# EAGLE schematic Connections (EAGLE 8.3.2)
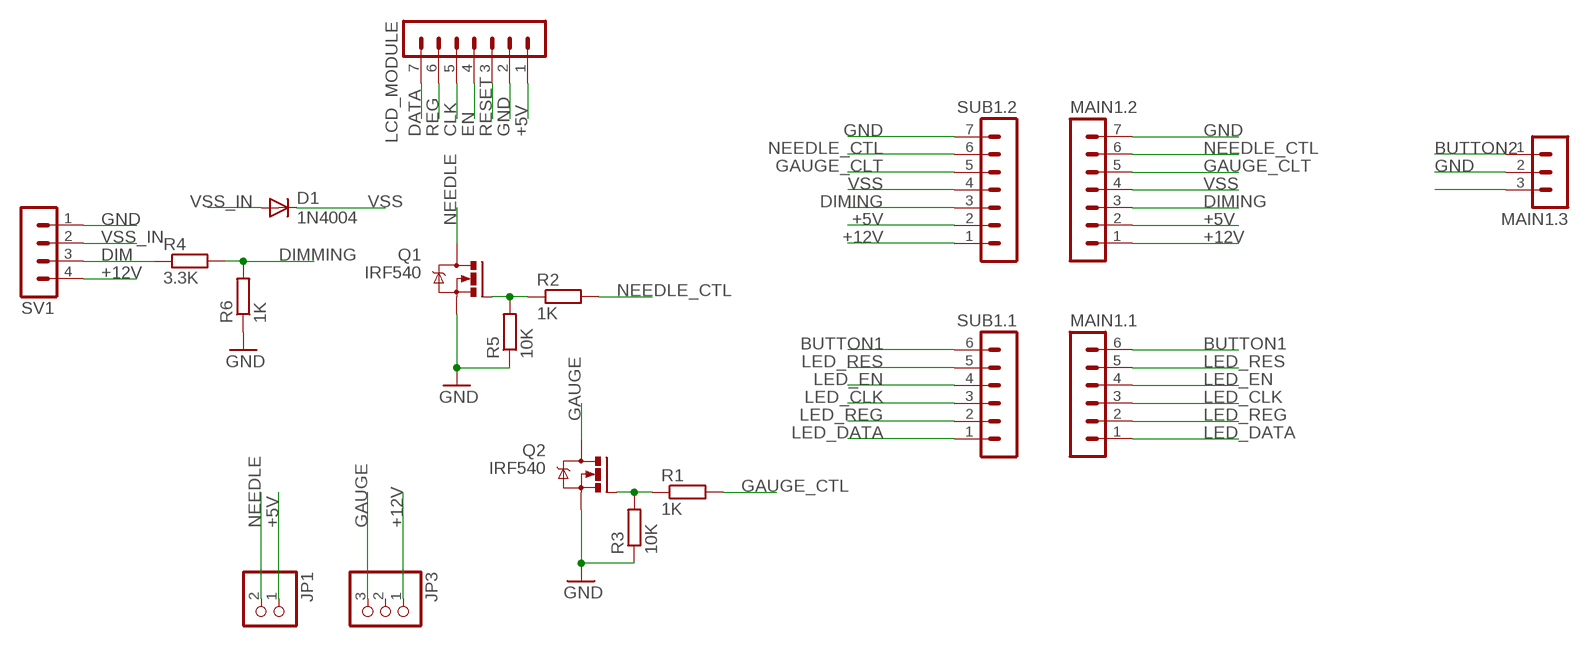
[diagram p0: schematic, sheet 1]

## Parts
D1  1N4004  [DO41-10]
JP1  PINHD-1X2  [1X02]
JP3  PINHD-1X3  [1X03]
LCD_MODULE  MA07-1  [MA07-1]
MAIN1.1  MA06-1  [MA06-1]
MAIN1.2  MA07-1  [MA07-1]
MAIN1.3  MA03-1  [MA03-1]
Q1  IRF540  [TO220BV]
Q2  IRF540  [TO220BV]
R1  1K  R-EU_0207/10  [0207/10]
R2  1K  R-EU_0207/10  [0207/10]
R3  10K  R-EU_0207/10  [0207/10]
R4  3.3K  R-EU_0207/10  [0207/10]
R5  10K  R-EU_0207/10  [0207/10]
R6  1K  R-EU_0207/10  [0207/10]
SUB1.1  MA06-1  [MA06-1]
SUB1.2  MA07-1  [MA07-1]
SV1  MA04-1  [MA04-1]

## Nets
+5V: JP1.1 LCD_MODULE.1 MAIN1.2.2 SUB1.2.2
+12V: MAIN1.2.1 SUB1.2.1 SV1.4
BUTTON1: MAIN1.1.6 SUB1.1.6
BUTTON2: MAIN1.3.1
CLK: LCD_MODULE.5
DATA: LCD_MODULE.7
DIM: R4.1 SV1.3
DIMING: MAIN1.2.3 SUB1.2.3
DIMMING: R4.2 R6.2
EN: LCD_MODULE.4
GAUGE: Q2.D
GAUGE_CLT: MAIN1.2.5 SUB1.2.5
GAUGE_CTL: R1.2
GND: LCD_MODULE.2 MAIN1.2.7 MAIN1.3.2 Q1.S Q2.S R3.1 R5.1 R6.1 SUB1.2.7 SV1.1
LED_CLK: MAIN1.1.3 SUB1.1.3
LED_DATA: MAIN1.1.1 SUB1.1.1
LED_EN: MAIN1.1.4 SUB1.1.4
LED_REG: MAIN1.1.2 SUB1.1.2
LED_RES: MAIN1.1.5 SUB1.1.5
N$3: MAIN1.3.3
N$5: Q2.G R1.1 R3.2
N$8: Q1.G R2.1 R5.2
NEEDLE: JP1.2 Q1.D
NEEDLE_CTL: MAIN1.2.6 R2.2 SUB1.2.6
REG: LCD_MODULE.6
RESET: LCD_MODULE.3
VSS: D1.C MAIN1.2.4 SUB1.2.4
VSS_IN: D1.A SV1.2
Unconnected: JP3.1 JP3.2 JP3.3

## Library data of the parts
D1 = adafruit:1N4004: DIODE General purpose 1N400x type rectifier (With bigger pads) http://www.ladyada.net/library/pcb/eaglelibrary.html
JP1 = pinhead:PINHD-1X2: PIN HEADER
JP3 = adafruit:PINHD-1X3: PIN HEADER
LCD_MODULE MAIN1.2 SUB1.2 = con-lstb:MA07-1: PIN HEADER; OC_FARNELL: unknown; OC_NEWARK: unknown
MAIN1.1 SUB1.1 = con-lstb:MA06-1: PIN HEADER; OC_FARNELL: unknown; OC_NEWARK: unknown
MAIN1.3 = con-lstb:MA03-1: PIN HEADER; OC_FARNELL: unknown; OC_NEWARK: unknown
Q1 Q2 = transistor-power:IRF540: HEXFET Power MOSFET
R1-R6 = rcl:R-EU_: RESISTOR, European symbol
SV1 = con-lstb:MA04-1: PIN HEADER; OC_FARNELL: unknown; OC_NEWARK: unknown